# Altium schematic sheet R.schdoc
size 127 x 99 mm
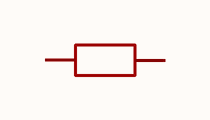
[diagram p0: R.schdoc]

## Parts
R?  1Ω  [R2512]  (value not drawn)

## Nets

Not connected (* = marked no-connect by the designer): R? 1 2

## Library data of the parts
R? = HoLRT2512-3W-1R-1%: Manufacturer: Milliohm(毫欧); Add into BOM: yes; Tolerance: ±1%; Power(Watts): 3W; Temperature Coefficient: ±50ppm/℃; Mounting Sytle: 贴片; Symbol: HOLRT2512-3W-1R-1%; Device: HoLRT2512-3W-1R-1%; LCSC Part Name: 1Ω ±1% 3W; Supplier Part: C5127857; Manufacturer Part: HoLRT2512-3W-1R-1%; Supplier Footprint: 2512; JLCPCB Part Class: Extended Part; Datasheet: https://atta.szlcsc.com/upload/public/pdf/source/20220824/2F980B1D038502AFD2CEFA614A55353B.pdf; Supplier: LCSC; Convert to PCB: yes; Type: 采样电阻; Value: 1Ω